# Altium schematic sheet RPi_PICO.SchDoc: Raspberry Pi Pico Remake
size A3; DrawnBy: ghanku; DocumentNumber: 1/1; Revision: V1I1; SheetNumber: 1; SheetTotal: 1; ImagePath: ss
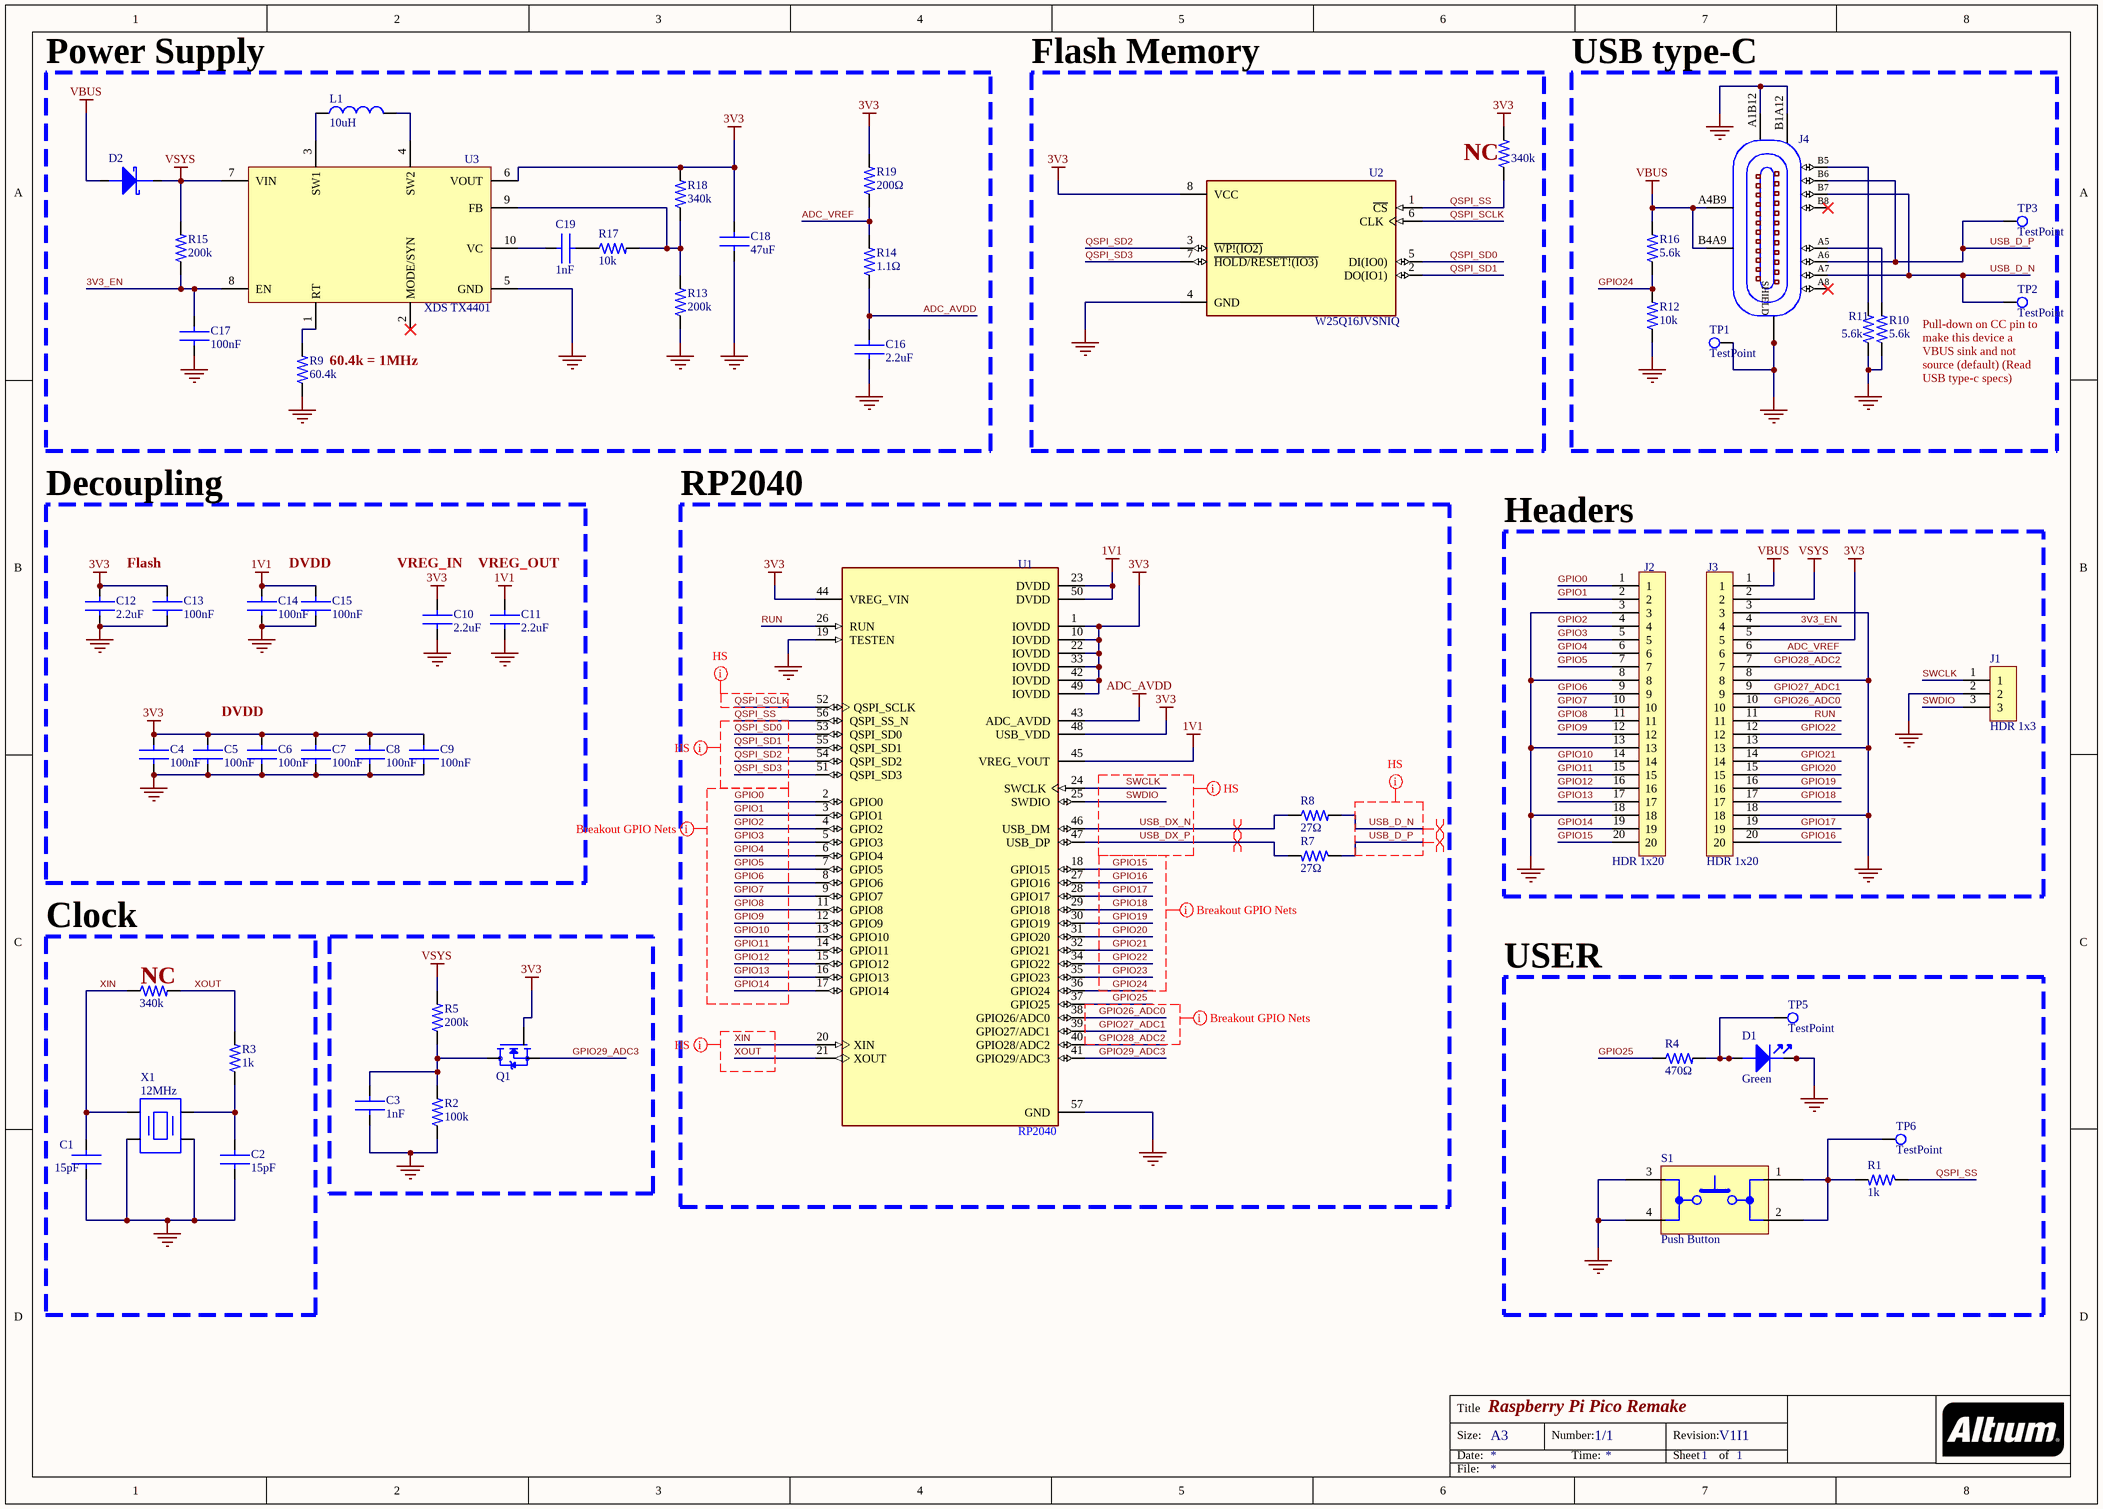
[diagram p0: RPi_PICO.SchDoc]

## Parts
C1  15pF  [MLCC-0201]
C2  15pF  [MLCC-0201]
C3  1nF  [MLCC-0201]
C4  100nF  [MLCC-0201]
C5  100nF  [MLCC-0201]
C6  100nF  [MLCC-0201]
C7  100nF  [MLCC-0201]
C8  100nF  [MLCC-0201]
C9  100nF  [MLCC-0201]
C10  2.2uF  [MLCC-0402]
C11  2.2uF  [MLCC-0402]
C12  2.2uF  [MLCC-0402]
C13  100nF  [MLCC-0201]
C14  100nF  [MLCC-0201]
C15  100nF  [MLCC-0201]
C16  2.2uF  [MLCC-0402]
C17  100nF  [MLCC-0201]
C18  47uF  [Ceramic_0805]
C19  1nF  [MLCC-0201]
D1  Green  [LED-0603]
D2  Schottky  [SOD-123F]  (value not drawn)
J1  HDR 1x3  [CONN-3-SMD+THT]  (no BOM)
J2  HDR 1x20  [Conn-20-SMD+THT]  (no BOM)
J3  HDR 1x20  [Conn-20-SMD+THT]  (no BOM)
J4  USB-type-c  [USB-type-c-31-M-12]  (value not drawn)
L1  10uH  [L-1515-SMD]
Q1  N-MOS  [SOT-523]  (value not drawn)
R1  1k  [R-0402]
R2  100k  [R-0402]
R3  1k  [R-0402]
R4  470Ω  [R-0402]
R5  200k  [R-0402]
R6  340k  [R-0402]  (no BOM)
R7  27Ω  [R-0201]
R8  27Ω  [R-0201]
R9  60.4k  [R-0402]
R10  5.6k  [R-0402]
R11  5.6k  [R-0402]
R12  10k  [R-0402]
R13  200k  [R-0402]
R14  1.1Ω  [R-0402]
R15  200k  [R-0402]
R16  5.6k  [R-0402]
R17  10k  [R-0402]
R18  340k  [R-0402]
R19  200Ω  [R_0603]
R20  340k  [R-0402]  (no BOM)
S1  Push Button  [SW_PB_6643]
TP1  TestPoint  [TestPoint-60mil-rectangle]  (no BOM)
TP2  TestPoint  [TestPoint-60mil-rectangle]  (no BOM)
TP3  TestPoint  [TestPoint-60mil-rectangle]  (no BOM)
TP5  TestPoint  [TestPoint-60mil-rectangle]  (no BOM)
TP6  TestPoint  [TestPoint-60mil-rectangle]  (no BOM)
U1  RP2040  [QFN56-RP2040]
U2  W25Q16JVSNIQ  [SOIC-8]
U3  XDS TX4401  [MSOP-10L]
X1  12MHz  [XTAL-SMD-3.2mm-2.5mm]

## Blocks framed on the sheet
Power Supply: C16-C19 D2 L1 R9 R13-R15 R17-R19 U3
Flash Memory: R20 U2
USB type-C: J4 R10-R12 R16 TP1-TP3
Decoupling: C4-C15
RP2040: R7 R8 U1
Headers: J1-J3
Clock: C1 C2 R3 R6 X1
USER: D1 R1 R4 S1 TP5 TP6

## Nets
1V1: C11.2 C14.2 C15.2 U1.23(DVDD) U1.45(VREG_VOUT) U1.50(DVDD)
3V3: C4.2 C5.2 C6.2 C7.2 C8.2 C9.2 C10.2 C12.2 C13.2 C18.2 J3.5 Q1.1(G) R18.2 R19.2 R20.2 U1.1(IOVDD) U1.10(IOVDD) U1.22(IOVDD) U1.33(IOVDD) U1.42(IOVDD) U1.44(VREG_VIN) U1.48(USB_VDD) U1.49(IOVDD) U2.8(VCC) U3.6(VOUT)
ADC_AVDD: C16.2 R14.1 U1.43(ADC_AVDD)
GND: C1.1 C2.1 C3.1 C4.1 C5.1 C6.1 C7.1 C8.1 C9.1 C10.1 C11.1 C12.1 C13.1 C14.1 C15.1 C16.1 C17.1 C18.1 D1.2(C) J1.2 J2.3 J2.8 J2.13 J2.18 J3.3 J3.8 J3.13 J3.18 J4.A1B12(GND) J4.B1A12(GND) J4.S1(SHIELD) J4.S2(SHIELD) J4.S3(SHIELD) J4.S4(SHIELD) R2.1 R9.1 R10.1 R11.1 R12.1 R13.1 S1.3 S1.4 TP1.1 U1.19(TESTEN) U1.57(GND) U2.4(GND) U3.5(GND) X1.2 X1.4
VBUS: D2.1(A) J3.1 J4.A4B9(VBUS) J4.B4A9(VBUS) R16.2
VSYS: D2.2(C) J3.2 R5.2 R15.2 U3.7(VIN)
3V3_EN: C17.2 J3.4 R15.1 U3.8(EN)
ADC_VREF: J3.6 R14.2 R19.1
GPIO0: J2.1 U1.2(GPIO0)
GPIO1: J2.2 U1.3(GPIO1)
GPIO2: J2.4 U1.4(GPIO2)
GPIO3: J2.5 U1.5(GPIO3)
GPIO4: J2.6 U1.6(GPIO4)
GPIO5: J2.7 U1.7(GPIO5)
GPIO6: J2.9 U1.8(GPIO6)
GPIO7: J2.10 U1.9(GPIO7)
GPIO8: J2.11 U1.11(GPIO8)
GPIO9: J2.12 U1.12(GPIO9)
GPIO10: J2.14 U1.13(GPIO10)
GPIO11: J2.15 U1.14(GPIO11)
GPIO12: J2.16 U1.15(GPIO12)
GPIO13: J2.17 U1.16(GPIO13)
GPIO14: J2.19 U1.17(GPIO14)
GPIO15: J2.20 U1.18(GPIO15)
GPIO16: J3.20 U1.27(GPIO16)
GPIO17: J3.19 U1.28(GPIO17)
GPIO18: J3.17 U1.29(GPIO18)
GPIO19: J3.16 U1.30(GPIO19)
GPIO20: J3.15 U1.31(GPIO20)
GPIO21: J3.14 U1.32(GPIO21)
GPIO22: J3.12 U1.34(GPIO22)
GPIO23: U1.35(GPIO23)
GPIO24: R12.2 R16.1 U1.36(GPIO24)
GPIO25: R4.1 U1.37(GPIO25)
GPIO26_ADC0: J3.10 U1.38(GPIO26/ADC0)
GPIO27_ADC1: J3.9 U1.39(GPIO27/ADC1)
GPIO28_ADC2: J3.7 U1.40(GPIO28/ADC2)
GPIO29_ADC3: Q1.3(S) U1.41(GPIO29/ADC3)
QSPI_SCLK: U1.52(QSPI_SCLK) U2.6(CLK)
QSPI_SD0: U1.53(QSPI_SD0) U2.5(DI(IO0))
QSPI_SD1: U1.55(QSPI_SD1) U2.2(DO(IO1))
QSPI_SD2: U1.54(QSPI_SD2) U2.3(~{WP!(IO2)})
QSPI_SD3: U1.51(QSPI_SD3) U2.7(~{HOLD/RESET!(IO3)})
QSPI_SS: R1.1 R20.1 U1.56(QSPI_SS_N) U2.1(~{CS})
RUN: J3.11 U1.26(RUN)
SWCLK: J1.1 U1.24(SWCLK)
SWDIO: J1.3 U1.25(SWDIO)
USB_D_N: J4.A7(DN1) J4.B7(DN2) R8.2 TP2.1
USB_D_P: J4.A6(DP1) J4.B6(DP2) R7.1 TP3.1
USB_DX_N: R8.1 U1.46(USB_DM)
USB_DX_P: R7.2 U1.47(USB_DP)
XIN: C1.2 R6.1 U1.20(XIN) X1.1
XOUT: R3.2 R6.2 U1.21(XOUT)
NetC2_2: C2.2 R3.1 X1.3
NetC3_2: C3.2 Q1.2(D) R2.2 R5.1
NetC19_1: C19.1 U3.10(VC)
NetC19_2: C19.2 R17.1
NetD1_1: D1.1(A) R4.2 TP5.1
NetJ4_A5: J4.A5(CC1) R10.2
NetJ4_B5: J4.B5(CC2) R11.2
NetL1_1: L1.1 U3.3(SW1)
NetL1_2: L1.2 U3.4(SW2)
NetR1_2: R1.2 S1.1 S1.2 TP6.1
NetR9_2: R9.2 U3.1(RT)
NetR13_2: R13.2 R17.2 R18.1 U3.9(FB)

Not connected (* = marked no-connect by the designer): J4 A8(SBU1)* B8(SBU2)*; U3 2(MODE/SYN)*

## Layout directives
differential pair: USB_D_N, USB_D_P, USB_DX_N, USB_DX_P
net class Breakout GPIO Nets: GPIO0, GPIO1, GPIO2, GPIO3, GPIO4, GPIO5, GPIO6, GPIO7, GPIO8, GPIO9, GPIO10, GPIO11, GPIO12, GPIO13, GPIO14, GPIO15, GPIO16, GPIO17, GPIO18, GPIO19, GPIO20, GPIO21, GPIO22, GPIO23, GPIO24, GPIO25, GPIO26_ADC0, GPIO27_ADC1, GPIO28_ADC2
net class HS: QSPI_SCLK, QSPI_SD0, QSPI_SD1, QSPI_SD2, QSPI_SD3, QSPI_SS, SWCLK, SWDIO, USB_D_N, USB_D_P, USB_DX_N, USB_DX_P, XIN, XOUT

## Notes on the sheet
- (near R20) NC
- (near R9) 60.4k = 1MHz
- (near TP2) Pull-down on CC pin to make this device a VBUS sink and not source (default) (Read USB type-c specs)
- Flash
- DVDD
- (near C10) VREG_IN
- VREG_OUT
- (near R6) NC
- Title
- Size:
- Date:
- A3
- Number:
- Time:
- Revision:
- Sheet
- of
- File:

## Library data of the parts
C1 C2 = 0201CG150J500NT: 15pF ±5% 50V 0201 C0G MLCC - SMD/SMT ROHS; Supplier 1: LCSC; JLC footprint: C0201; ComponentLink1Description: LCSC link 1; ComponentLink1URL: https://www.lcsc.com/product-detail/Multilayer-Ceramic-Capacitors-MLCC-SMD-SMT_FH-Guangdong-Fenghua-Advanced-Tech-0201CG150J500NT_C64554.html; ComponentLink2Description: LCSC link 2; ComponentLink2URL: https://www.lcsc.com/product-detail/Multilayer-Ceramic-Capacitors-MLCC-SMD-SMT_Samsung-Electro-Mechanics-CL03A104KQ3NNNH_C170154.html; Supplier Part Number 2: C304668; Supplier Part Number 1: C64554; Supplier 2: LCSC
C3 C19 = CC0201KRX7R9BB102: 1nF ±10% 50V 0201  X7R  MLCC - SMD/SMT ROHS; Supplier 1: LCSC; JLC footprint: C0201; ComponentLink1Description: LCSC link 1; ComponentLink1URL: https://www.lcsc.com/product-detail/Multilayer-Ceramic-Capacitors-MLCC-SMD-SMT_YAGEO-CC0201KRX7R9BB102_C505464.html; ComponentLink2Description: LCSC link 2; ComponentLink2URL: https://www.lcsc.com/product-detail/Multilayer-Ceramic-Capacitors-MLCC-SMD-SMT_Murata-Electronics-GRM033R71E102KA01D_C76943.html; Supplier Part Number 2: C76943; Supplier Part Number 1: C505464; Supplier 2: LCSC
C4-C9 C13-C15 C17 = CL03A104KP3NNNC: 100nF ±10% 10V 0201 X5R MLCC - SMD/SMT ROHS; Supplier 1: LCSC; JLC footprint: C0201; ComponentLink1Description: LCSC link 1; ComponentLink1URL: https://www.lcsc.com/product-detail/Multilayer-Ceramic-Capacitors-MLCC-SMD-SMT_Samsung-Electro-Mechanics-CL03A104KP3NNNC_C49062.html; ComponentLink2Description: LCSC link 2; ComponentLink2URL: https://www.lcsc.com/product-detail/Multilayer-Ceramic-Capacitors-MLCC-SMD-SMT_Samsung-Electro-Mechanics-CL03A104KQ3NNNH_C170154.html; Supplier 3: LCSC; Supplier Part Number 3: C76939; ComponentLink3Description: LCSC link 3; ComponentLink3URL: https://www.lcsc.com/product-detail/Multilayer-Ceramic-Capacitors-MLCC-SMD-SMT_Murata-Electronics-GRM033R61E104KE14D_C76939.html; Supplier Part Number 2: C170154; Supplier Part Number 1: C49062; Supplier 2: LCSC
C10-C12 C16 = CL05A225MQ5NSNC: 2.2uF ±20% 6.3V 0402 X5R   MLCC - SMD/SMT ROHS; Supplier 1: LCSC; JLC footprint: C0402; ComponentLink1Description: LCSC link 1; ComponentLink1URL: https://www.lcsc.com/product-detail/Multilayer-Ceramic-Capacitors-MLCC-SMD-SMT_Samsung-Electro-Mechanics-CL05A225MQ5NSNC_C12530.html; ComponentLink2Description: LCSC link 2; ComponentLink2URL: https://www.lcsc.com/product-detail/Multilayer-Ceramic-Capacitors-MLCC-SMD-SMT_Samsung-Electro-Mechanics-CL05A225KO5NQNC_C170151.html; Supplier 3: LCSC; Supplier Part Number 3: C77002; ComponentLink3Description: LCSC link 3; ComponentLink3URL: https://www.lcsc.com/product-detail/Multilayer-Ceramic-Capacitors-MLCC-SMD-SMT_Murata-Electronics-GRM155R61A225KE95D_C77002.html; Supplier Part Number 2: C170151; Supplier Part Number 1: C12530; Supplier 2: LCSC
C18 = CL21A476MQYNNNE: 47uF 6.3V ±20% 0805   X5R MLCC - SMD/SMT ROHS; Supplier 1: LCSC; JLC footprint: C0805; ComponentLink1Description: LCSC link 1; ComponentLink1URL: https://www.lcsc.com/product-detail/Multilayer-Ceramic-Capacitors-MLCC-SMD-SMT_Samsung-Electro-Mechanics-CL21A476MQYNNNE_C16780.html; ComponentLink2Description: LCSC link 2; ComponentLink2URL: https://www.lcsc.com/product-detail/Multilayer-Ceramic-Capacitors-MLCC-SMD-SMT_TDK-C2012X5R1A476MTJ00E_C76636.html; Supplier 3: LCSC; Supplier Part Number 3: C77072; ComponentLink3Description: LCSC link 3; ComponentLink3URL: https://www.lcsc.com/product-detail/Multilayer-Ceramic-Capacitors-MLCC-SMD-SMT_Murata-Electronics-GRM21BR60J476ME15L_C77072.html; Supplier Part Number 2: C76636; Supplier Part Number 1: C16780; Supplier 2: LCSC
D1 = 19-217/GHC-YR1S2/3T: LED Green 20mA 285mcd 3.3V 518nm Colorless transparence -40℃~+85℃ 520nm~535nm Emerald 120° 110mW 0603  ROHS; Supplier 1: LCSC; Supplier Part Number 1: C72043; ComponentLink1Description: LCSC link 1; ComponentLink1URL: https://www.lcsc.com/product-detail/Light-Emitting-Diodes-LED_Everlight-Elec-19-217-GHC-YR1S2-3T_C72043.html; Supplier 2: LCSC; ComponentLink2Description: LCSC link 2; ComponentLink2URL: https://www.lcsc.com/product-detail/Light-Emitting-Diodes-LED_Orient-ORH-G36G_C205443.html; JLC footprint: LED0603-R-RD; Supplier Part Number 2: C205443
D2 = RB161MM-20CT-ND: Diode Schottky 20 V 1A Surface Mount SOD-123FL; ComponentLink1Description: LCSC link 1; ComponentLink1URL: https://lcsc.com/product-detail/Schottky-Barrier-Diodes-SBD_ROHM-Semicon-RB161MM-20TR_C123070.html; Supplier 1: LCSC; Supplier 2: Digi-Key; Supplier Part Number 1: C123070; Supplier Part Number 2: RB161MM-20CT-ND
J1 = HDR 1x3 2.54mm double: HDR 1x3 2.54mm double SMD+THT
J2 J3 = HDR 1x20 2.54mm double: HDR 1x20 2.54mm double SMD+THT
J4 = USB-type-c: 250mA 1 16 Female Type-C SMD USB Connectors ROHS; Supplier 1: LCSC; ComponentLink1Description: LCSC link 1; ComponentLink1URL: https://www.lcsc.com/product-detail/USB-Connectors_Korean-Hroparts-Elec-TYPE-C-31-M-12_C165948.html; Supplier Part Number 1: C165948; JLC footprint: USB-C_SMD-TYPE-C-31-M-12
L1 = FDSD0420-H-100M=P3: 1.7A 10uH ±20% 2.5A 165mΩ - Inductors (SMD) ROHS; Supplier 1: LCSC; Supplier Part Number 1: C1329533; ComponentLink1Description: LCSC link 1; ComponentLink1URL: https://www.lcsc.com/product-detail/Inductors-SMD_Murata-Electronics-FDSD0420-H-100M-P3_C1329533.html; JLC footprint: IND-SMD_L4.0-W4.0_LQH44PN2R2MP0L
Q1 = TPCJ1012: 20V 800mA 180mΩ@4.5V,550mA 280mW 750mV@250uA 15pF@16V N Channel 120pF@16V +150℃@(Tj) SOT-523 MOSFETs ROHS; ComponentLink1Description: LCSC link 1; ComponentLink1URL: https://www.lcsc.com/product-detail/MOSFETs_TECH-PUBLIC-TPCJ1012_C2830305.html; Supplier 1: LCSC; Supplier Part Number 1: C2830305; JLC footprint: SOT-523-3_L1.6-W0.8-P1.00-LS1.6-BR
R1 R3 = 0402WGF1001TCE: 1kΩ ±1% 62.5mW 50V 0402 Thick Film Resistors  ±100ppm/℃  -55℃~+155℃   Chip Resistor - Surface Mount ROHS; Supplier 1: LCSC; Supplier Part Number 1: C11702; ComponentLink1Description: LCSC link 1; ComponentLink1URL: https://www.lcsc.com/product-detail/Chip-Resistor-Surface-Mount_UNI-ROYAL-Uniroyal-Elec-0402WGF1001TCE_C11702.html; Supplier 2: LCSC; Supplier Part Number 2: C226166; ComponentLink2Description: LCSC link 2; ComponentLink2URL: https://www.lcsc.com/product-detail/Chip-Resistor-Surface-Mount_FH-Guangdong-Fenghua-Advanced-Tech-RC-02W1001FT_C226166.html; JLC footprint: R0402; ComponentLink3Description: LCSC link 3; ComponentLink3URL: https://www.lcsc.com/product-detail/Chip-Resistor-Surface-Mount_Ever-Ohms-Tech-CR0402J1K00Q10Z_C881213.html; Supplier 3: LCSC; Supplier Part Number 3: C881213
R2 = 0402WGF1003TCE: 100kΩ ±1% 62.5mW 50V  0402 Thick Film Resistors ±100ppm/℃  -55℃~+155℃  Chip Resistor - Surface Mount ROHS; Supplier 1: LCSC; Supplier Part Number 1: C25741; ComponentLink1Description: LCSC link 1; ComponentLink1URL: https://www.lcsc.com/product-detail/Chip-Resistor-Surface-Mount_UNI-ROYAL-Uniroyal-Elec-0402WGF1003TCE_C25741.html; Supplier 2: LCSC; Supplier Part Number 2: C60491; ComponentLink2Description: LCSC link 2; ComponentLink2URL: https://www.lcsc.com/product-detail/Chip-Resistor-Surface-Mount_YAGEO-RC0402FR-07100KL_C60491.html; Supplier 3: LCSC; Supplier Part Number 3: C384388; ComponentLink3Description: LCSC link 3; ComponentLink3URL: https://www.lcsc.com/product-detail/Chip-Resistor-Surface-Mount_Walsin-Tech-Corp-WR04X104JTL_C384388.html; JLC footprint: R0402
R4 = 0402WGF4700TCE: 470Ω 62.5mW 50V 0402 Thick Film Resistors  ±100ppm/℃ ±1% -55℃~+155℃   Chip Resistor - Surface Mount ROHS; Supplier 1: LCSC; Supplier Part Number 1: C25117; ComponentLink1Description: LCSC link 1; ComponentLink1URL: https://www.lcsc.com/product-detail/Chip-Resistor-Surface-Mount_UNI-ROYAL-Uniroyal-Elec-0402WGF4700TCE_C25117.html; Supplier 2: LCSC; Supplier Part Number 2: C25167; ComponentLink2Description: LCSC link 2; ComponentLink2URL: https://www.lcsc.com/product-detail/Chip-Resistor-Surface-Mount_UNI-ROYAL-Uniroyal-Elec-0402WGJ0471TCE_C25167.html; Supplier 3: LCSC; Supplier Part Number 3: C471786; ComponentLink3Description: LCSC link 3; ComponentLink3URL: https://www.lcsc.com/product-detail/Chip-Resistor-Surface-Mount_YAGEO-RC0402DR-07470RL_C471786.html; JLC footprint: R0402
R5 R13 R15 = 0402WGF2003TCE: 200kΩ ±1% 62.5mW 50V 0402  Thick Film Resistors  ±100ppm/℃  -55℃~+155℃ Chip Resistor - Surface Mount ROHS; Supplier 1: LCSC; Supplier Part Number 1: C25764; ComponentLink1Description: LCSC link 1; ComponentLink1URL: https://www.lcsc.com/product-detail/Chip-Resistor-Surface-Mount_UNI-ROYAL-Uniroyal-Elec-0402WGF2003TCE_C25764.html; Supplier 2: LCSC; Supplier Part Number 2: C25544; ComponentLink2Description: LCSC link 2; ComponentLink2URL: https://www.lcsc.com/product-detail/Chip-Resistor-Surface-Mount_UNI-ROYAL-Uniroyal-Elec-0402WGJ0204TCE_C25544.html; JLC footprint: R0402
R6 R18 R20 = WR04X3403FTL: 340kΩ ±1% 62.5mW 50V 0402  Thick Film Resistors  ±100ppm/℃  -55℃~+155℃ Chip Resistor - Surface Mount ROHS; Supplier 1: LCSC; Supplier Part Number 1: C334688; ComponentLink1Description: LCSC link 1; ComponentLink1URL: https://www.lcsc.com/product-detail/Chip-Resistor-Surface-Mount_Walsin-Tech-Corp-WR04X3403FTL_C334688.html; JLC footprint: R0402
R7 R8 = RC0201JR-0727RL: 27Ω ±5% 50mW 25V 0201 Thick Film Resistors  ±200ppm/℃  -55℃~+125℃  Chip Resistor - Surface Mount ROHS; Supplier 1: LCSC; Supplier Part Number 1: C273295; ComponentLink1Description: LCSC link 1; ComponentLink1URL: https://www.lcsc.com/product-detail/Chip-Resistor-Surface-Mount_YAGEO-RC0201JR-0727RL_C273295.html; JLC footprint: R0201
R9 = 0402WGF6042TCE: 60.4kΩ ±1% 62.5mW 0402 50V Thick Film Resistors  ±100ppm/℃  -55℃~+155℃  Chip Resistor - Surface Mount ROHS; Supplier 1: LCSC; Supplier Part Number 1: C25911; ComponentLink1Description: LCSC link 1; ComponentLink1URL: https://www.lcsc.com/product-detail/Chip-Resistor-Surface-Mount_UNI-ROYAL-Uniroyal-Elec-0402WGF6042TCE_C25911.html; JLC footprint: R0402
R10 R11 R16 = 0402WGF5601TCE: 5.6kΩ ±1% 62.5mW 50V 0402 Thick Film Resistors  ±100ppm/℃  -55℃~+155℃  Chip Resistor - Surface Mount ROHS; Supplier 1: LCSC; Supplier Part Number 1: C25908; ComponentLink1Description: LCSC link 1; ComponentLink1URL: https://www.lcsc.com/product-detail/Chip-Resistor-Surface-Mount_UNI-ROYAL-Uniroyal-Elec-0402WGF5601TCE_C25908.html; Supplier 2: LCSC; Supplier Part Number 2: C286562; ComponentLink2Description: LCSC link 2; ComponentLink2URL: https://www.lcsc.com/product-detail/Chip-Resistor-Surface-Mount_FH-Guangdong-Fenghua-Advanced-Tech-RC-02W5601FT_C286562.html; JLC footprint: R0402; ComponentLink3Description: LCSC link 3; ComponentLink3URL: https://www.lcsc.com/product-detail/Chip-Resistor-Surface-Mount_UNI-ROYAL-Uniroyal-Elec-0402WGJ0562TCE_C25942.html; Supplier 3: LCSC; Supplier Part Number 3: C25942
R12 R17 = RC0402FR-0710KL: 10kΩ ±1% 62.5mW 50V 0402 Thick Film Resistors  ±100ppm/℃  -55℃~+155℃   Chip Resistor - Surface Mount ROHS; Supplier 1: LCSC; Supplier Part Number 1: C25744; ComponentLink1Description: LCSC link 1; ComponentLink1URL: https://www.lcsc.com/product-detail/Chip-Resistor-Surface-Mount_UNI-ROYAL-Uniroyal-Elec-0402WGF1002TCE_C25744.html; Supplier 2: LCSC; Supplier Part Number 2: C60490; ComponentLink2Description: LCSC link 2; ComponentLink2URL: https://www.lcsc.com/product-detail/Chip-Resistor-Surface-Mount_YAGEO-RC0402FR-0710KL_C60490.html; Supplier 3: LCSC; Supplier Part Number 3: C140214; ComponentLink3Description: LCSC link 3; ComponentLink3URL: https://www.lcsc.com/product-detail/Chip-Resistor-Surface-Mount_FH-Guangdong-Fenghua-Advanced-Tech-RC-02W103JT_C140214.html; JLC footprint: R0402
R14 = 0402WGJ011JTCE: 1.1Ω ±5% 62.5mW 50V 0402 Thick Film Resistors  ±400ppm/℃ -55℃~+155℃ Chip Resistor - Surface Mount ROHS; Supplier 1: LCSC; Supplier Part Number 1: C11803; ComponentLink1Description: LCSC link 1; ComponentLink1URL: https://www.lcsc.com/product-detail/Chip-Resistor-Surface-Mount_UNI-ROYAL-Uniroyal-Elec-0402WGJ011JTCE_C11803.html; Supplier 2: LCSC; Supplier Part Number 2: C227325; ComponentLink2Description: LCSC link 2; ComponentLink2URL: https://www.lcsc.com/product-detail/Chip-Resistor-Surface-Mount_YAGEO-AC0402JR-071R1L_C227325.html; JLC footprint: R0402
R19 = 0603WAF2000T5E: 200Ω ±1% 200mW 50V 0603 Thick Film Resistors  ±100ppm/℃  -55℃~+125℃  Chip Resistor - Surface Mount ROHS; Supplier 1: LCSC; Supplier Part Number 1: C8218; ComponentLink1Description: LCSC link 1; ComponentLink1URL: https://www.lcsc.com/product-detail/Chip-Resistor-Surface-Mount_UNI-ROYAL-Uniroyal-Elec-0603WAF2000T5E_C8218.html; Supplier 2: LCSC; Supplier Part Number 2: C25217; ComponentLink2Description: LCSC link 2; ComponentLink2URL: https://www.lcsc.com/product-detail/Chip-Resistor-Surface-Mount_UNI-ROYAL-Uniroyal-Elec-0603WAJ0201T5E_C25217.html; ComponentLink3Description: LCSC link 3; ComponentLink3URL: https://www.lcsc.com/product-detail/Chip-Resistor-Surface-Mount_Resistor-Today-HPCR0603F200RK9_C365116.html; Supplier 3: LCSC; Supplier Part Number 3: C365116; JLC footprint: R0603
S1 = GT-TC089B-H043-L1: SPST tactile switch SMD 6x6x4.3mm; ComponentLink1Description: LCSC link 1; ComponentLink1URL: https://lcsc.com/product-detail/Tactile-Switches_XKB-Connectivity-TS-1145A-B-A_C318904.html; Supplier 1: LCSC; Supplier Part Number 1: C318904
U1 = RP2040: MCU, 32BIT, 133MHZ, QFN-56; Product Range:-; Architecture:ARM Cortex-M0+; No. of Bits:32bit; CPU Speed:133MHz; Program Memory Size:16MB; RAM Memory Size:264KB; No. of Pins:56Pins; MCU Case Style:QFN; No. of I/O s:30I/O s; Supplier 1: LCSC; Supplier 2: Digi-Key; Supplier 3: Digi-Key; Supplier Part Number 2: 2648-SC0914(7)CT-ND; Supplier Part Number 1: C2040; Supplier Part Number 3: 2648-SC0914(13)CT-ND; ComponentLink1Description: LCSC link 1; ComponentLink1URL: https://www.lcsc.com/product-detail/Microcontroller-Units-MCUs-MPUs-SOCs_Raspberry-Pi-RP2040_C2040.html; JLC footprint: LQFN-56_L7.0-W7.0-P0.4-EP
U2 = W25Q16JVSNIQ: FLASH - NOR Memory IC 16Mb (2M x 8) SPI - Quad I/O 133 MHz SOIC-8; Supplier 1: LCSC; Supplier 2: Digi-Key; Supplier Part Number 1: C115407; Supplier Part Number 2: W25Q16JVSNIQCT-ND; ComponentLink1Description: LCSC link 1; ComponentLink1URL: https://www.lcsc.com/product-detail/NOR-FLASH_Winbond-Elec-W25Q16JVSNIQ_C115407.html; JLC footprint: SOIC-8_L4.9-W3.9-P1.27-LS6.0-BL
U3 = XDS-TX4401: Buck-boost type -40℃~+85℃ 1 1.8V~5.5V 2.5V~5.5V 1A 1uA MSOP-10L DC-DC Converters ROHS; Supplier 1: LCSC; Supplier Part Number 1: C448641; ComponentLink1Description: LCSC link 1; ComponentLink1URL: https://www.lcsc.com/product-detail/DC-DC-Converters_XDS-TX4401_C448641.html; JLC footprint: MSOP-10_L3.0-W3.0-P0.50-LS5.0-BL
X1 = HCI CO32H4-12.000-WPJHPSN: 12MHz HCMOS 1.8V~3.3V -20℃~+70℃ ±30ppm  SMD3225-4P Oscillators ROHS; Supplier 1: LCSC; ComponentLink1Description: LCSC link 1; ComponentLink1URL: https://www.lcsc.com/product-detail/Crystals_HCI-XC32M4-12-000-F12JJHP_C2842187.html; JLC footprint: OSC-SMD_4P-L3.2-W2.5-BL; Supplier Part Number 1: C2842187